# Altium schematic sheet Semikron_SKS_170F_B6Ci_141_V12.SchDoc
size A; SheetNumber: 4; SheetTotal: 6
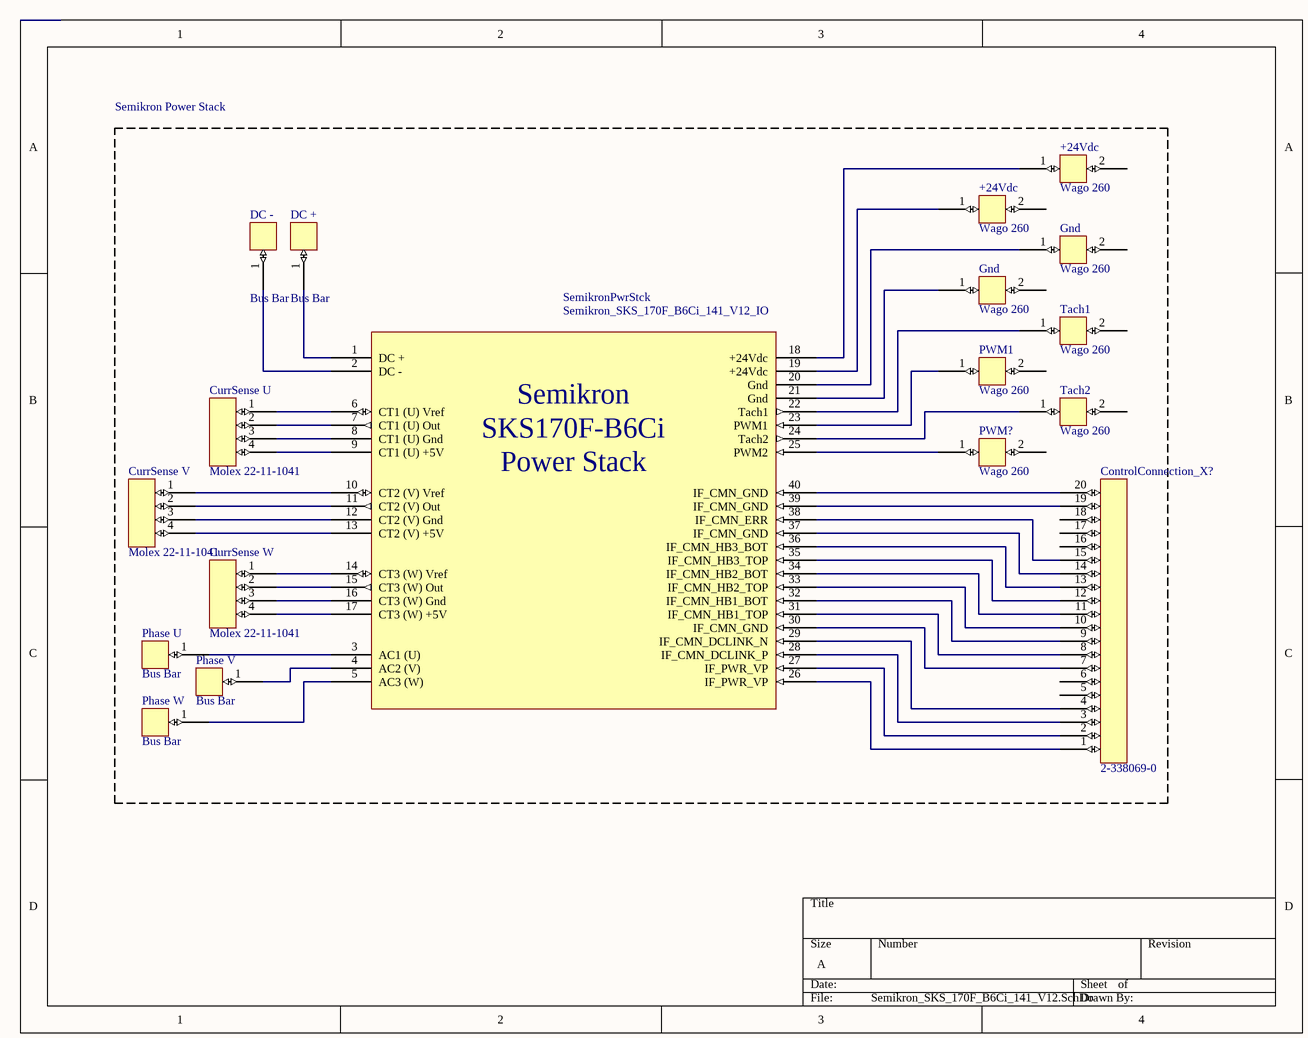
[diagram p0: Semikron_SKS_170F_B6Ci_141_V12.SchDoc]

## Parts
(Parts that share a designator on the sheet are numbered #1, #2 ... from top to bottom, then left to right.)
+24Vdc#1  Wago 260
+24Vdc#2  Wago 260
ControlConnection_X?  2-338069-0
CurrSense_U  Molex 22-11-1041
CurrSense_V  Molex 22-11-1041
CurrSense_W  Molex 22-11-1041
DC_+  Bus Bar
DC_-  Bus Bar
Gnd#1  Wago 260
Gnd#2  Wago 260
Phase_U  Bus Bar
Phase_V  Bus Bar
Phase_W  Bus Bar
PWM1  Wago 260
PWM?  Wago 260
SemikronPwrStck  Semikron_SKS_170F_B6Ci_141_V12_IO
Tach1  Wago 260
Tach2  Wago 260

## Blocks framed on the sheet
Semikron Power Stack: +24Vdc#1 +24Vdc#2 ControlConnection_X? CurrSense_U CurrSense_V CurrSense_W DC_+ DC_- Gnd#1 Gnd#2 Phase_U Phase_V Phase_W PWM1 PWM? SemikronPwrStck Tach1 Tach2

## Nets
Net+24Vdc#1_1: +24Vdc#1.1 SemikronPwrStck.18(+24Vdc)
Net+24Vdc#2_1: +24Vdc#2.1 SemikronPwrStck.19(+24Vdc)
NetControlConnection_X?_1: ControlConnection_X?.1 SemikronPwrStck.26(IF_PWR_VP)
NetControlConnection_X?_2: ControlConnection_X?.2 SemikronPwrStck.27(IF_PWR_VP)
NetControlConnection_X?_3: ControlConnection_X?.3 SemikronPwrStck.28(IF_CMN_DCLINK_P)
NetControlConnection_X?_4: ControlConnection_X?.4 SemikronPwrStck.29(IF_CMN_DCLINK_N)
NetControlConnection_X?_7: ControlConnection_X?.7 SemikronPwrStck.30(IF_CMN_GND)
NetControlConnection_X?_8: ControlConnection_X?.8 SemikronPwrStck.31(IF_CMN_HB1_TOP)
NetControlConnection_X?_9: ControlConnection_X?.9 SemikronPwrStck.32(IF_CMN_HB1_BOT)
NetControlConnection_X?_10: ControlConnection_X?.10 SemikronPwrStck.33(IF_CMN_HB2_TOP)
NetControlConnection_X?_11: ControlConnection_X?.11 SemikronPwrStck.34(IF_CMN_HB2_BOT)
NetControlConnection_X?_12: ControlConnection_X?.12 SemikronPwrStck.35(IF_CMN_HB3_TOP)
NetControlConnection_X?_13: ControlConnection_X?.13 SemikronPwrStck.36(IF_CMN_HB3_BOT)
NetControlConnection_X?_14: ControlConnection_X?.14 SemikronPwrStck.37(IF_CMN_GND)
NetControlConnection_X?_15: ControlConnection_X?.15 SemikronPwrStck.38(IF_CMN_ERR)
NetControlConnection_X?_19: ControlConnection_X?.19 SemikronPwrStck.39(IF_CMN_GND)
NetControlConnection_X?_20: ControlConnection_X?.20 SemikronPwrStck.40(IF_CMN_GND)
NetCurrSense_U_1: CurrSense_U.1 SemikronPwrStck.6(CT1_(U)_Vref)
NetCurrSense_U_2: CurrSense_U.2 SemikronPwrStck.7(CT1_(U)_Out)
NetCurrSense_U_3: CurrSense_U.3 SemikronPwrStck.8(CT1_(U)_Gnd)
NetCurrSense_U_4: CurrSense_U.4 SemikronPwrStck.9(CT1_(U)_+5V)
NetCurrSense_V_1: CurrSense_V.1 SemikronPwrStck.10(CT2_(V)_Vref)
NetCurrSense_V_2: CurrSense_V.2 SemikronPwrStck.11(CT2_(V)_Out)
NetCurrSense_V_3: CurrSense_V.3 SemikronPwrStck.12(CT2_(V)_Gnd)
NetCurrSense_V_4: CurrSense_V.4 SemikronPwrStck.13(CT2_(V)_+5V)
NetCurrSense_W_1: CurrSense_W.1 SemikronPwrStck.14(CT3_(W)_Vref)
NetCurrSense_W_2: CurrSense_W.2 SemikronPwrStck.15(CT3_(W)_Out)
NetCurrSense_W_3: CurrSense_W.3 SemikronPwrStck.16(CT3_(W)_Gnd)
NetCurrSense_W_4: CurrSense_W.4 SemikronPwrStck.17(CT3_(W)_+5V)
NetDC_+_1: DC_+.1 SemikronPwrStck.1(DC_+)
NetDC_-_1: DC_-.1 SemikronPwrStck.2(DC_-)
NetGnd#1_1: Gnd#1.1 SemikronPwrStck.20(Gnd)
NetGnd#2_1: Gnd#2.1 SemikronPwrStck.21(Gnd)
NetPhase_U_1: Phase_U.1 SemikronPwrStck.3(AC1_(U))
NetPhase_V_1: Phase_V.1 SemikronPwrStck.4(AC2_(V))
NetPhase_W_1: Phase_W.1 SemikronPwrStck.5(AC3_(W))
NetPWM1_1: PWM1.1 SemikronPwrStck.23(PWM1)
NetPWM?_1: PWM?.1 SemikronPwrStck.25(PWM2)
NetSemikronPwrStck_22: SemikronPwrStck.22(Tach1) Tach1.1
NetSemikronPwrStck_24: SemikronPwrStck.24(Tach2) Tach2.1

Not connected (* = marked no-connect by the designer): +24Vdc#1 2; +24Vdc#2 2; ControlConnection_X? 5 6 16 17 18; Gnd#1 2; Gnd#2 2; PWM1 2; PWM? 2; Tach1 2; Tach2 2

## Notes on the sheet
- (in symbol CMP-001-0001-3) Semikron; SKS170F-B6Ci; Power Stack

## Library data of the parts
+24Vdc#1 +24Vdc#2 Gnd#1 Gnd#2 PWM1 PWM? Tach1 Tach2 = CMP-002-00072-3: 28-16 AWG Spring Clamp Terminal Block - DIN Mountable
ControlConnection_X? = CMP-002-00071-1: Conn FFC Connector F 20 POS 2.54mm Solder ST SMD T/R
CurrSense_U CurrSense_V CurrSense_W = CMP-002-00073-1: Headers & Wire Housings 2.5MM VERT 4P HDR W/FRICTION RAMP AU
DC_+ DC_- Phase_U Phase_V Phase_W = CMP-001-0000-1: Single Connection bus bar
SemikronPwrStck = CMP-001-0001-3: IO connections of Semikron power stack. Intended to route to connectors used on the power stack such that external connecting equipment can be shown in schematic form w/ appropriate mating connector.